# EAGLE design rc2014_template (EAGLE 8.1.0)
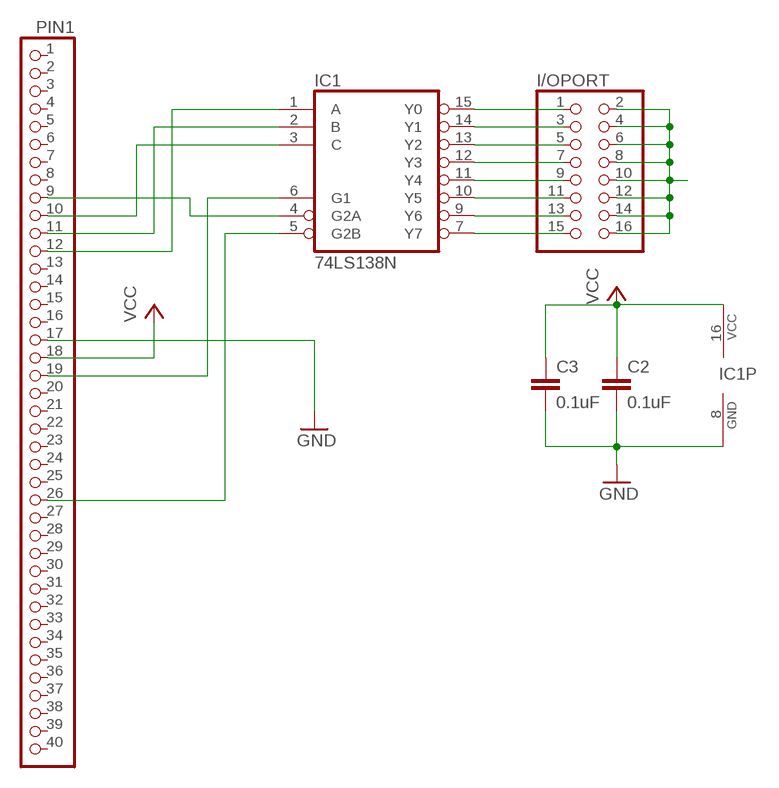
[diagram p0: schematic, sheet 1]

## Parts
C2  0.1uF  C-EU050-024X044  [C050-024X044]
C3  0.1uF  C-EU050-024X044  [C050-024X044]
I/OPORT  PINHD-2X8  [2X08]
IC1  74LS138N  [DIL16]
PIN1  PINHD-1X40  [1X40]

## Nets
GND: C2.2 C3.2 IC1.8(GND) PIN1.17
N$1: IC1.6(G1) PIN1.19
N$2: IC1.5(G2B) PIN1.26
N$3: IC1.4(G2A) PIN1.9
N$4: IC1.3(C) PIN1.10
N$5: IC1.2(B) PIN1.11
N$6: IC1.1(A) PIN1.12
N$7: I/OPORT.1 IC1.15(Y0)
N$8: I/OPORT.3 IC1.14(Y1)
N$9: I/OPORT.5 IC1.13(Y2)
N$10: I/OPORT.7 IC1.12(Y3)
N$11: I/OPORT.9 IC1.11(Y4)
N$12: I/OPORT.11 IC1.10(Y5)
N$13: I/OPORT.13 IC1.9(Y6)
N$14: I/OPORT.15 IC1.7(Y7)
N$15: I/OPORT.2 I/OPORT.4 I/OPORT.6 I/OPORT.8 I/OPORT.10 I/OPORT.12 I/OPORT.14 I/OPORT.16
VCC: C2.1 C3.1 IC1.16(VCC) PIN1.18
Unconnected: PIN1.1 PIN1.2 PIN1.3 PIN1.4 PIN1.5 PIN1.6 PIN1.7 PIN1.8 PIN1.13 PIN1.14 PIN1.15 PIN1.16 PIN1.20 PIN1.21 PIN1.22 PIN1.23 PIN1.24 PIN1.25 PIN1.27 PIN1.28 PIN1.29 PIN1.30 PIN1.31 PIN1.32 PIN1.33 PIN1.34 PIN1.35 PIN1.36 PIN1.37 PIN1.38 PIN1.39 PIN1.40

## Library data of the parts
C2 C3 = rcl:C-EU: CAPACITOR, European symbol
I/OPORT = pinhead:PINHD-2X8: PIN HEADER
IC1 = 74xx-us:74*138: 3-line to 8-line DECODER/DEMULTIPLEXER
PIN1 = pinhead:PINHD-1X40: PIN HEADER

## Net classes
0 +5V: width 0.508 mm

## Board
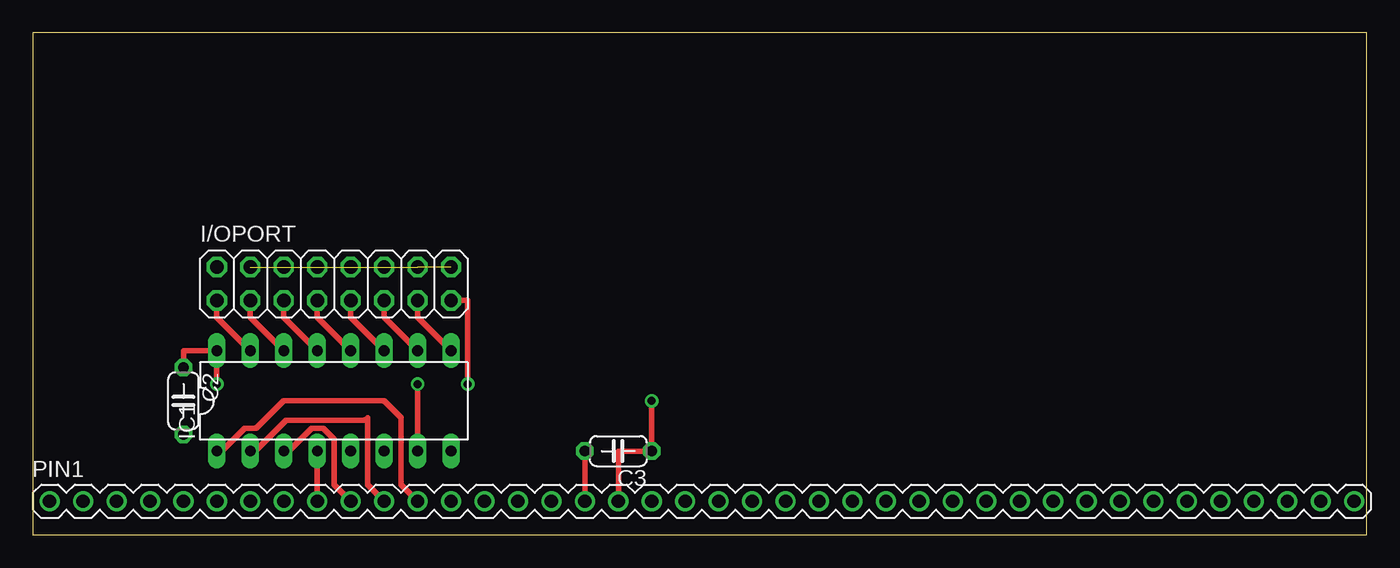
[diagram p1: board, top side]
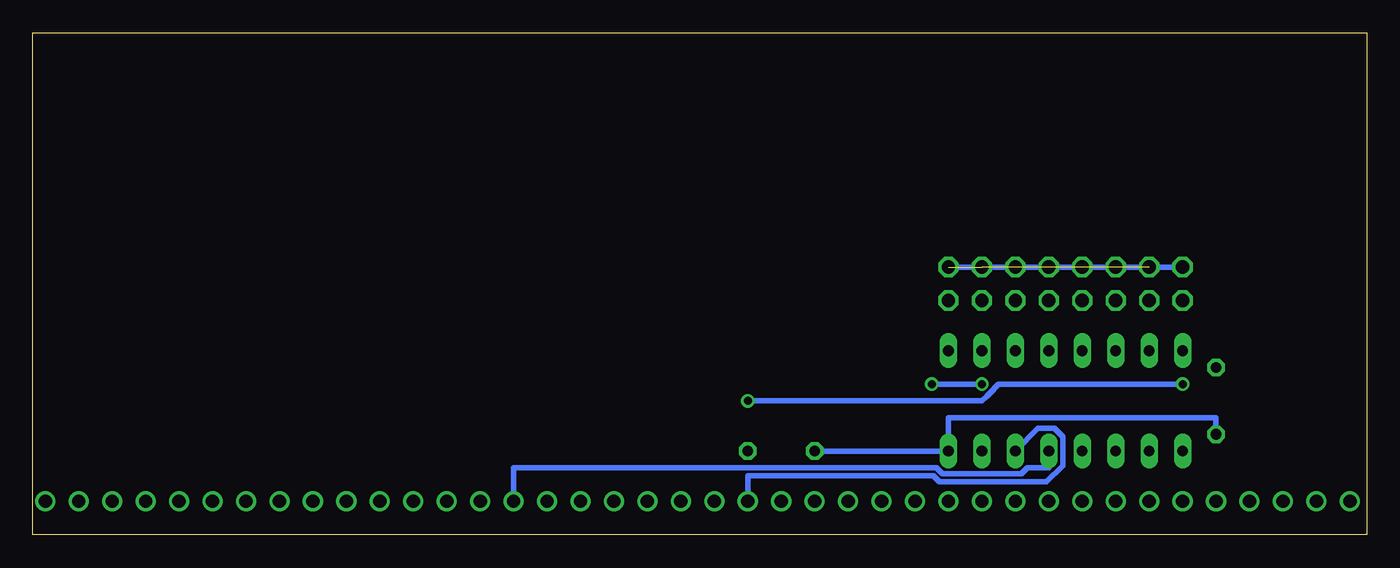
[diagram p2: board, bottom side, seen from below]

Size 101.27 x 38.09 mm. Coordinates in mm from the lower left corner, seen from the top.
Outline: 0,0 101.27,0 101.27,38.09 0,38.09 0,0
Copper layers (1*16): Top 0.035mm / dielectric 1.5mm / Bottom 0.035mm
Design rules "default *": minimum track width 20mil, minimum drill 24mil, track to track 8mil, track to pad 8mil, pad to pad 8mil, via to via 8mil, smd to smd 8mil, copper to edge 40mil, drill to drill 8mil, minimum pad ring 10mil, minimum via ring 8mil, stop-mask expansion 4mil, vias tented up to drill 0mil, thermal gap 10mil

### Footprints (pad centres in the part's own frame; a part is rotated, then mirrored left to right if it is on the bottom)
C050-024X044 = drill 0.813 octagon: 1 -2.54,0; 2 2.54,0
2X08 = drill 1.016 octagon: 1 -8.89,-1.27; 2 -8.89,1.27; 3 -6.35,-1.27; 4 -6.35,1.27; 5 -3.81,-1.27; 6 -3.81,1.27; 7 -1.27,-1.27; 8 -1.27,1.27; 9 1.27,-1.27; 10 1.27,1.27; 11 3.81,-1.27; 12 3.81,1.27; 13 6.35,-1.27; 14 6.35,1.27; 15 8.89,-1.27; 16 8.89,1.27
DIL16 = drill 0.813 long: 1 -8.89,-3.81; 2 -6.35,-3.81; 3 -3.81,-3.81; 4 -1.27,-3.81; 5 1.27,-3.81; 6 3.81,-3.81; 7 6.35,-3.81; 8 8.89,-3.81; 9 8.89,3.81; 10 6.35,3.81; 11 3.81,3.81; 12 1.27,3.81; 13 -1.27,3.81; 14 -3.81,3.81; 15 -6.35,3.81; 16 -8.89,3.81
1X40 = drill 1.016: 1 -49.53,0; 2 -46.99,0; 3 -44.45,0; 4 -41.91,0; 5 -39.37,0; 6 -36.83,0; 7 -34.29,0; 8 -31.75,0; 9 -29.21,0; 10 -26.67,0; 11 -24.13,0; 12 -21.59,0; 13 -19.05,0; 14 -16.51,0; 15 -13.97,0; 16 -11.43,0; 17 -8.89,0; 18 -6.35,0; 19 -3.81,0; 20 -1.27,0; 21 1.27,0; 22 3.81,0; 23 6.35,0; 24 8.89,0; 25 11.43,0; 26 13.97,0; 27 16.51,0; 28 19.05,0; 29 21.59,0; 30 24.13,0; 31 26.67,0; 32 29.21,0; 33 31.75,0; 34 34.29,0; 35 36.83,0; 36 39.37,0; 37 41.91,0; 38 44.45,0; 39 46.99,0; 40 49.53,0

### Placement (x,y rotation side)
C2  11.43,10.16 270 top
C3  44.45,6.35 180 top
I/OPORT  22.86,19.05 0 top
IC1  22.86,10.16 0 top
PIN1  50.8,2.54 0 top

### Tracks (layer width: path | path; a pad name or v marks a point on that pad's centre or on a via)
GND
  Top 0.406: C3.2 PIN1.17
  Bottom 0.406: C3.2 IC1.8 31.75,8.89 11.43,8.89 C2.2
N$1
  Bottom 0.406: IC1.6 24.94,8.08 23.69,8.08 23.06,7.45 23.06,5.25 24.3,4.01 32.44,4.01 32.9,4.47 46.99,4.47 PIN1.19
N$2
  Bottom 0.406: IC1.5 24.13,5.08 25.77,5.08 26.23,4.62 32.19,4.62 32.65,5.08 64.77,5.08 PIN1.26
N$3
  Top 0.406: IC1.4 PIN1.9
N$4
  Top 0.406: PIN1.10 22.86,3.81 22.86,7.25 22.03,8.08 21.15,8.08 19.42,6.35 IC1.3
N$5
  Top 0.406: IC1.2 16.88,6.35 19.22,8.69 25.2,8.69 25.4,8.89 25.4,3.81 PIN1.11
N$6
  Top 0.406: IC1.1 14.34,6.35 16.07,8.08 16.97,8.08 19.05,10.16 26.67,10.16 27.94,8.89 27.94,3.81 PIN1.12
N$7
  Top 0.406: IC1.15 13.97,16.51 I/OPORT.1
N$8
  Top 0.406: IC1.14 16.51,16.51 I/OPORT.3
N$9
  Top 0.406: IC1.13 19.05,16.51 I/OPORT.5
N$10
  Top 0.406: IC1.12 21.59,16.51 I/OPORT.7
N$11
  Top 0.406: IC1.11 24.13,16.51 I/OPORT.9
N$12
  Top 0.406: IC1.10 26.67,16.51 I/OPORT.11
N$13
  Top 0.406: IC1.9 29.21,16.51 I/OPORT.13
N$14  (via drill 0.61)
  Top 0.406: IC1.7 v29.21,11.43 | v33.02,11.43 33.02,17.78 I/OPORT.15
  Bottom 0.406: v29.21,11.43 v33.02,11.43
N$15  (6 unrouted)
  Bottom 0.406: I/OPORT.2 I/OPORT.16
VCC  (via drill 0.61)
  Top 0.406: C2.1 11.43,13.97 IC1.16 v13.97,11.43 | PIN1.18 44.45,6.35 C3.1 v46.99,10.16
  Bottom 0.406: v13.97,11.43 27.94,11.43 28.3,11.07 28.3,11.05 28.83,10.52 28.85,10.52 29.21,10.16 v46.99,10.16